# Altium project MB1246.PrjPCB
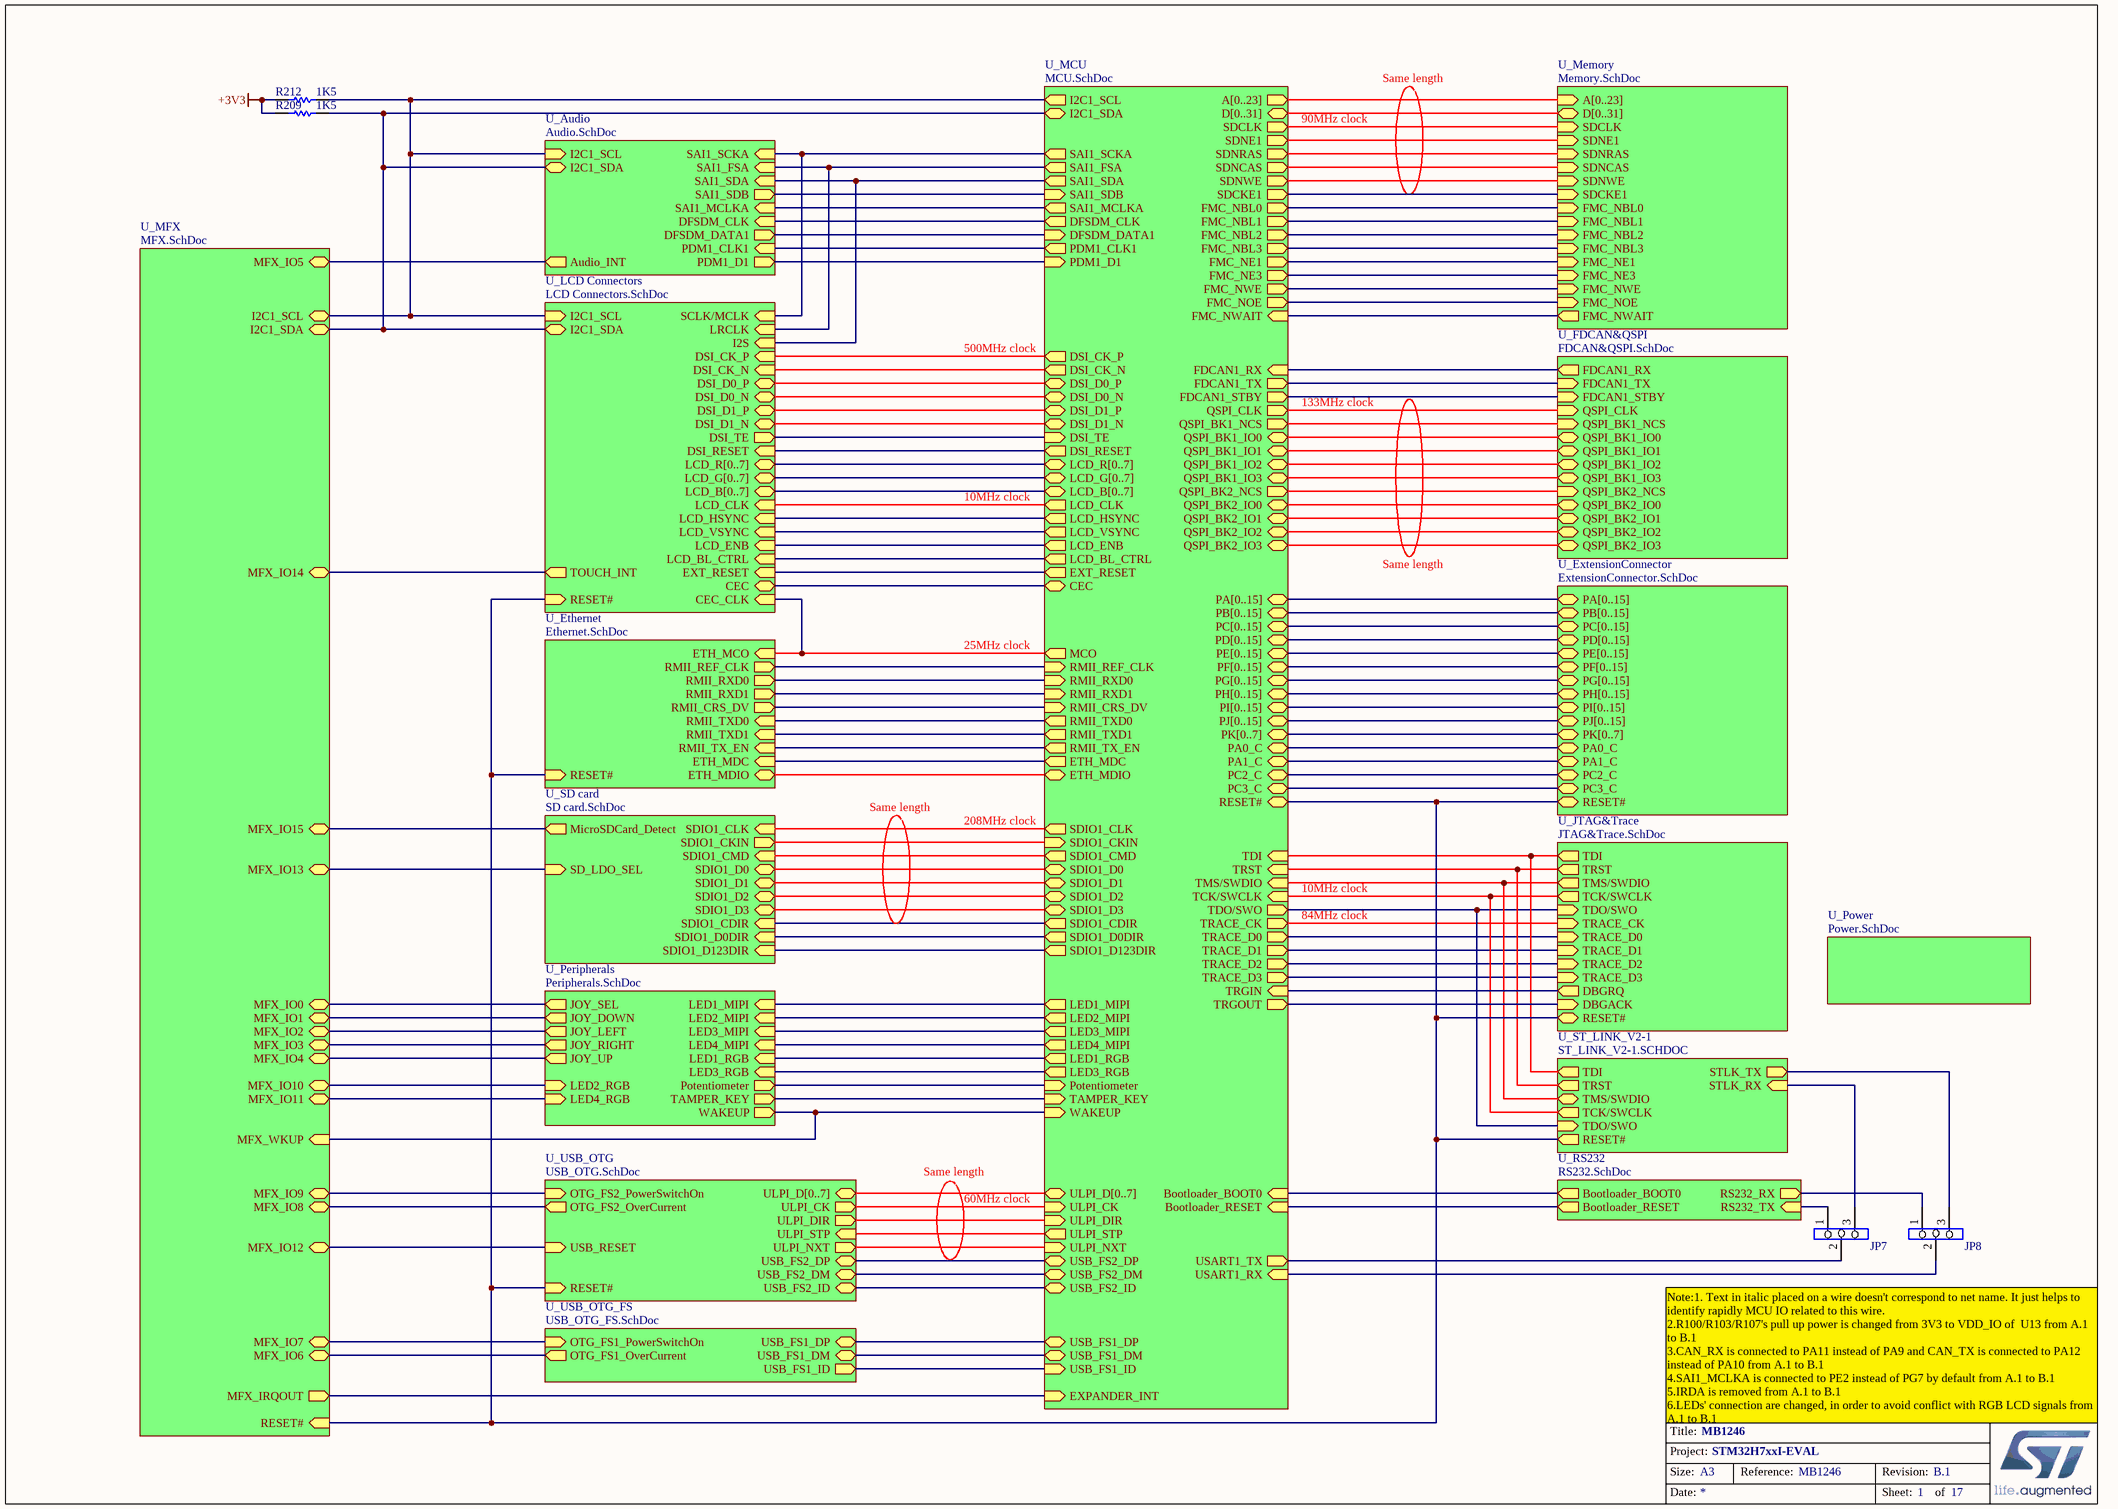
[diagram p0: MB1246.SchDoc]
4 sheets, 93 parts. Net scope: hierarchical (ports join the sheet entries above them; power ports are global).
Sheets:
  MB1246.SchDoc
    U_Audio = Audio.SchDoc
    U_MFX = MFX.SchDoc
    U_USB_OTG_FS = USB_OTG_FS.SchDoc

## Sheet MB1246.SchDoc: MB1246
size A3; DocumentNumber: MB1246; Revision: B.1; SheetNumber: 1; SheetTotal: 17; Project: STM32H7xxI-EVAL

### Parts
JP7  (no value)  [SIP3]
JP8  (no value)  [SIP3]
R209  1K5  [0603R]
R212  1K5  [0603R]

### Sub-sheets
U_Audio = Audio.SchDoc: SAI1_SCKA (in), SAI1_FSA (in), SAI1_SDA (in), SAI1_SDB (out), Audio_INT (out), I2C1_SDA (bidir), I2C1_SCL (in), SAI1_MCLKA (in), DFSDM_CLK (in), DFSDM_DATA1 (out), PDM1_CLK1 (in), PDM1_D1 (out)
U_Ethernet = Ethernet.SchDoc (file not in this document): ETH_MCO (in), RMII_TXD0 (in), RMII_TX_EN (in), RMII_RXD0 (out), RMII_REF_CLK (out), RMII_CRS_DV (out), ETH_MDC (in), ETH_MDIO (bidir), RMII_TXD1 (in), RMII_RXD1 (out), RESET# (in)
U_ExtensionConnector = ExtensionConnector.SchDoc (file not in this document): PA[0..15] (bidir), PB[0..15] (bidir), PC[0..15] (bidir), PD[0..15] (bidir), PE[0..15] (bidir), PF[0..15] (bidir), PG[0..15] (bidir), PH[0..15] (bidir), PI[0..15] (bidir), PJ[0..15] (bidir), PK[0..7] (bidir), RESET# (bidir), PA0_C (bidir), PA1_C (bidir), PC2_C (bidir), PC3_C (bidir)
U_FDCAN&QSPI = FDCAN&QSPI.SchDoc (file not in this document): FDCAN1_TX (in), FDCAN1_RX (out), FDCAN1_STBY (in), QSPI_BK1_IO3 (bidir), QSPI_BK1_IO1 (bidir), QSPI_BK1_NCS (in), QSPI_BK1_IO0 (bidir), QSPI_BK1_IO2 (bidir), QSPI_CLK (in), QSPI_BK2_NCS (in), QSPI_BK2_IO0 (bidir), QSPI_BK2_IO1 (bidir), QSPI_BK2_IO2 (bidir), QSPI_BK2_IO3 (bidir)
U_JTAG&Trace = JTAG&Trace.SchDoc (file not in this document): TDI (out), RESET# (bidir), TRACE_D3 (in), TRACE_D2 (in), TRACE_D1 (in), TRACE_D0 (in), TRACE_CK (in), TRST (out), TMS/SWDIO (out), TCK/SWCLK (out), TDO/SWO (in), DBGRQ (out), DBGACK (in)
U_LCD Connectors = LCD Connectors.SchDoc (file not in this document): LCD_R[0..7] (bidir), LCD_HSYNC (in), LCD_VSYNC (in), LCD_CLK (in), LCD_ENB (in), I2C1_SDA (bidir), I2C1_SCL (in), LCD_B[0..7] (bidir), LCD_G[0..7] (bidir), TOUCH_INT (out), EXT_RESET (in), DSI_CK_P (in), DSI_CK_N (in), DSI_D0_P (bidir), DSI_D0_N (bidir), DSI_D1_P (bidir), DSI_D1_N (bidir), LCD_BL_CTRL (in), DSI_TE (out), DSI_RESET (in), SCLK/MCLK (in), LRCLK (in), I2S (in), CEC (bidir), CEC_CLK (in), RESET# (in)
U_MCU = MCU.SchDoc (file not in this document): PA[0..15] (bidir), PB[0..15] (bidir), PC[0..15] (bidir), PD[0..15] (bidir), PE[0..15] (bidir), PF[0..15] (bidir), PG[0..15] (bidir), PH[0..15] (bidir), PI[0..15] (bidir), TMS/SWDIO (in), TCK/SWCLK (in), TDI (in), ULPI_STP (out), ETH_MDC (out), RMII_RXD0 (in), RMII_RXD1 (in), SDIO1_D0 (bidir), EXT_RESET (out), SDIO1_CLK (out), TAMPER_KEY (in), LCD_ENB (out), SDIO1_CMD (out), FMC_NOE (out), FMC_NWE (out), FMC_NWAIT (in), FMC_NE1 (out), FMC_NBL3 (out), FMC_NBL2 (out), EXPANDER_INT (in), ULPI_DIR (in), LCD_HSYNC (out), LCD_VSYNC (out), LCD_CLK (out), FMC_NBL0 (out), FMC_NBL1 (out), TRACE_CK (out), TRACE_D0 (out), TRACE_D2 (out), TRACE_D1 (out), SAI1_SDA (out), TRACE_D3 (out), SAI1_SDB (in), SAI1_SCKA (out), SAI1_FSA (out), SAI1_MCLKA (out), SDNRAS (out), SDCLK (out), FMC_NE3 (out), RMII_TX_EN (out), RMII_TXD1 (out), SDNCAS (out), SDCKE1 (out), SDNE1 (out), ULPI_NXT (in), SDNWE (out), LCD_G[0..7] (bidir), LCD_B[0..7] (bidir), D[0..31] (bidir), A[0..23] (out), ULPI_D[0..7] (bidir), PJ[0..15] (bidir), PK[0..7] (bidir), LCD_R[0..7] (bidir), QSPI_BK1_IO3 (bidir), QSPI_BK1_IO2 (bidir), QSPI_BK1_IO1 (bidir), QSPI_BK1_IO0 (bidir), DSI_TE (in), DSI_CK_P (out), DSI_CK_N (out), DSI_D0_P (bidir), DSI_D0_N (bidir), DSI_D1_P (bidir), DSI_D1_N (bidir), DSI_RESET (out), LED1_MIPI (out), LED2_MIPI (out), LED3_MIPI (out), LED4_MIPI (out), RMII_REF_CLK (in), ETH_MDIO (bidir), ULPI_CK (in), RMII_CRS_DV (in), LCD_BL_CTRL (out), USART1_TX (out), USART1_RX (in), USB_FS1_ID (in), FDCAN1_RX (in), USB_FS1_DM (bidir), FDCAN1_TX (out), USB_FS1_DP (bidir), MCO (out), WAKEUP (in), TDO/SWO (out), TRST (in), I2C1_SCL (out), I2C1_SDA (bidir), USB_FS2_ID (bidir), USB_FS2_DM (bidir), USB_FS2_DP (bidir), QSPI_BK1_NCS (out), RMII_TXD0 (out), QSPI_CLK (out), SDIO1_CKIN (in), SDIO1_CDIR (out), DFSDM_CLK (out), DFSDM_DATA1 (in), SDIO1_D0DIR (out), SDIO1_D123DIR (out), SDIO1_D1 (bidir), SDIO1_D2 (bidir), SDIO1_D3 (bidir), FDCAN1_STBY (out), PDM1_CLK1 (out), PDM1_D1 (in), QSPI_BK2_IO2 (bidir), QSPI_BK2_IO3 (bidir), QSPI_BK2_IO0 (bidir), QSPI_BK2_IO1 (bidir), RESET# (bidir), Bootloader_BOOT0 (in), Bootloader_RESET (in), PA0_C (bidir), PA1_C (bidir), PC2_C (bidir), PC3_C (bidir), QSPI_BK2_NCS (out), CEC (bidir), Potentiometer (in), TRGOUT (out), TRGIN (in), LED1_RGB (out), LED3_RGB (out)
U_Memory = Memory.SchDoc (file not in this document): FMC_NE1 (in), FMC_NWE (in), FMC_NOE (in), FMC_NWAIT (out), FMC_NBL0 (in), FMC_NBL1 (in), D[0..31] (bidir), A[0..23] (in), SDNCAS (in), SDNWE (in), SDNRAS (in), SDNE1 (in), SDCKE1 (in), SDCLK (in), FMC_NBL3 (in), FMC_NBL2 (in), FMC_NE3 (in)
U_MFX = MFX.SchDoc: MFX_IRQOUT (out), I2C1_SDA (bidir), I2C1_SCL (bidir), MFX_IO5 (bidir), MFX_IO6 (bidir), MFX_IO7 (bidir), MFX_IO8 (bidir), MFX_IO9 (bidir), MFX_IO10 (bidir), MFX_IO11 (bidir), MFX_IO12 (bidir), MFX_IO13 (bidir), MFX_IO14 (bidir), MFX_IO15 (bidir), MFX_WKUP (in), MFX_IO0 (bidir), MFX_IO1 (bidir), MFX_IO2 (bidir), MFX_IO3 (bidir), MFX_IO4 (bidir), RESET# (in)
U_Peripherals = Peripherals.SchDoc (file not in this document): JOY_SEL (out), JOY_DOWN (out), JOY_LEFT (out), JOY_RIGHT (out), JOY_UP (out), TAMPER_KEY (out), WAKEUP (out), Potentiometer (out), LED4_MIPI (in), LED3_MIPI (in), LED1_MIPI (in), LED2_MIPI (in), LED1_RGB (in), LED2_RGB (in), LED3_RGB (in), LED4_RGB (in)
U_Power = Power.SchDoc (file not in this document): no entries
U_RS232 = RS232.SchDoc (file not in this document): RS232_TX (in), RS232_RX (out), Bootloader_BOOT0 (out), Bootloader_RESET (out)
U_SD card = SD card.SchDoc (file not in this document): SDIO1_CKIN (out), SDIO1_CDIR (in), SDIO1_D0DIR (in), SDIO1_D123DIR (in), SDIO1_D0 (bidir), SDIO1_D1 (bidir), SDIO1_D2 (bidir), SDIO1_D3 (bidir), SDIO1_CMD (in), SDIO1_CLK (in), SD_LDO_SEL (in), MicroSDCard_Detect (out)
U_ST_LINK_V2-1 = ST_LINK_V2-1.SCHDOC (file not in this document): STLK_RX (in), STLK_TX (out), TDI (out), TRST (out), TMS/SWDIO (bidir), TCK/SWCLK (out), TDO/SWO (in), RESET# (out)
U_USB_OTG = USB_OTG.SchDoc (file not in this document): ULPI_D[0..7] (bidir), ULPI_CK (out), ULPI_DIR (out), ULPI_NXT (out), ULPI_STP (in), USB_RESET (in), USB_FS2_DM (bidir), USB_FS2_DP (bidir), OTG_FS2_PowerSwitchOn (in), OTG_FS2_OverCurrent (out), USB_FS2_ID (bidir), RESET# (in)
U_USB_OTG_FS = USB_OTG_FS.SchDoc: OTG_FS1_PowerSwitchOn (in), OTG_FS1_OverCurrent (out), USB_FS1_DM (bidir), USB_FS1_DP (bidir), USB_FS1_ID (out)

### Nets
+3V3: R209.1 R212.1
NetCN18_2: sheet U_USB_OTG_FS/USB_FS1_DM, sheet U_MCU/USB_FS1_DM
NetCN18_3: sheet U_USB_OTG_FS/USB_FS1_DP, sheet U_MCU/USB_FS1_DP
NetCN18_4: sheet U_USB_OTG_FS/USB_FS1_ID, sheet U_MCU/USB_FS1_ID
NetD15_2: sheet U_ExtensionConnector/RESET#, sheet U_MFX/RESET#, sheet U_ST_LINK_V2-1/RESET#, sheet U_JTAG&Trace/RESET#, sheet U_Ethernet/RESET#, sheet U_MCU/RESET#, sheet U_USB_OTG/RESET#, sheet U_LCD Connectors/RESET#
NetJP7_1: JP7.1 ; sheet U_RS232/RS232_TX
NetJP7_2: JP7.2 ; sheet U_MCU/USART1_TX
NetJP7_3: JP7.3 ; sheet U_ST_LINK_V2-1/STLK_RX
NetJP8_1: JP8.1 ; sheet U_RS232/RS232_RX
NetJP8_2: JP8.2 ; sheet U_MCU/USART1_RX
NetJP8_3: JP8.3 ; sheet U_ST_LINK_V2-1/STLK_TX
NetR141_2: sheet U_MFX/MFX_IO7, sheet U_USB_OTG_FS/OTG_FS1_PowerSwitchOn
NetR146_1: sheet U_MFX/MFX_IO6, sheet U_USB_OTG_FS/OTG_FS1_OverCurrent
NetR155_1: R212.2 ; sheet U_Audio/I2C1_SCL, sheet U_MFX/I2C1_SCL, sheet U_MCU/I2C1_SCL, sheet U_LCD Connectors/I2C1_SCL
NetR160_1: R209.2 ; sheet U_Audio/I2C1_SDA, sheet U_MFX/I2C1_SDA, sheet U_MCU/I2C1_SDA, sheet U_LCD Connectors/I2C1_SDA
NetR173_2: sheet U_MFX/MFX_WKUP, sheet U_Peripherals/WAKEUP, sheet U_MCU/WAKEUP
NetR185_1: sheet U_MFX/MFX_IRQOUT, sheet U_MCU/EXPANDER_INT
NetSW2_2: sheet U_Audio/DFSDM_CLK, sheet U_MCU/DFSDM_CLK
NetSW2_4: sheet U_Audio/PDM1_CLK1, sheet U_MCU/PDM1_CLK1
NetSW2_6: sheet U_Audio/DFSDM_DATA1, sheet U_MCU/DFSDM_DATA1
NetSW2_8: sheet U_Audio/PDM1_D1, sheet U_MCU/PDM1_D1
NetU22_D3: sheet U_Audio/SAI1_MCLKA, sheet U_MCU/SAI1_MCLKA
NetU22_E3: sheet U_Audio/SAI1_FSA, sheet U_MCU/SAI1_FSA, sheet U_LCD Connectors/LRCLK
NetU22_E4: sheet U_Audio/SAI1_SDA, sheet U_MCU/SAI1_SDA, sheet U_LCD Connectors/I2S
NetU22_F2: sheet U_Audio/SAI1_SDB, sheet U_MCU/SAI1_SDB
NetU22_G1: sheet U_Audio/SAI1_SCKA, sheet U_MCU/SAI1_SCKA, sheet U_LCD Connectors/SCLK/MCLK
NetU22_G3: sheet U_Audio/Audio_INT, sheet U_MFX/MFX_IO5
NetU24_18: sheet U_MFX/MFX_IO0, sheet U_Peripherals/JOY_SEL
NetU24_19: sheet U_MFX/MFX_IO1, sheet U_Peripherals/JOY_DOWN
NetU24_20: sheet U_MFX/MFX_IO2, sheet U_Peripherals/JOY_LEFT
NetU24_26: sheet U_MFX/MFX_IO13, sheet U_SD card/SD_LDO_SEL
NetU24_27: sheet U_MFX/MFX_IO14, sheet U_LCD Connectors/TOUCH_INT
NetU24_28: sheet U_MFX/MFX_IO15, sheet U_SD card/MicroSDCard_Detect
NetU24_29: sheet U_MFX/MFX_IO8, sheet U_USB_OTG/OTG_FS2_OverCurrent
NetU24_30: sheet U_MFX/MFX_IO9, sheet U_USB_OTG/OTG_FS2_PowerSwitchOn
NetU24_31: sheet U_MFX/MFX_IO10, sheet U_Peripherals/LED2_RGB
NetU24_32: sheet U_MFX/MFX_IO11, sheet U_Peripherals/LED4_RGB
NetU24_33: sheet U_MFX/MFX_IO12, sheet U_USB_OTG/USB_RESET
NetU24_39: sheet U_MFX/MFX_IO3, sheet U_Peripherals/JOY_RIGHT
NetU24_40: sheet U_MFX/MFX_IO4, sheet U_Peripherals/JOY_UP
(unnamed): sheet U_ExtensionConnector/PA0_C, sheet U_MCU/PA0_C
(unnamed): sheet U_ExtensionConnector/PA1_C, sheet U_MCU/PA1_C
(unnamed): sheet U_ExtensionConnector/PC2_C, sheet U_MCU/PC2_C
(unnamed): sheet U_ExtensionConnector/PC3_C, sheet U_MCU/PC3_C
(unnamed): sheet U_FDCAN&QSPI/FDCAN1_TX, sheet U_MCU/FDCAN1_TX
(unnamed): sheet U_FDCAN&QSPI/FDCAN1_RX, sheet U_MCU/FDCAN1_RX
(unnamed): sheet U_FDCAN&QSPI/FDCAN1_STBY, sheet U_MCU/FDCAN1_STBY
(unnamed): sheet U_FDCAN&QSPI/QSPI_BK1_IO3, sheet U_MCU/QSPI_BK1_IO3
(unnamed): sheet U_FDCAN&QSPI/QSPI_BK1_IO1, sheet U_MCU/QSPI_BK1_IO1
(unnamed): sheet U_FDCAN&QSPI/QSPI_BK1_NCS, sheet U_MCU/QSPI_BK1_NCS
(unnamed): sheet U_FDCAN&QSPI/QSPI_BK1_IO0, sheet U_MCU/QSPI_BK1_IO0
(unnamed): sheet U_FDCAN&QSPI/QSPI_BK1_IO2, sheet U_MCU/QSPI_BK1_IO2
(unnamed): sheet U_FDCAN&QSPI/QSPI_CLK, sheet U_MCU/QSPI_CLK
(unnamed): sheet U_FDCAN&QSPI/QSPI_BK2_NCS, sheet U_MCU/QSPI_BK2_NCS
(unnamed): sheet U_FDCAN&QSPI/QSPI_BK2_IO0, sheet U_MCU/QSPI_BK2_IO0
(unnamed): sheet U_FDCAN&QSPI/QSPI_BK2_IO1, sheet U_MCU/QSPI_BK2_IO1
(unnamed): sheet U_FDCAN&QSPI/QSPI_BK2_IO2, sheet U_MCU/QSPI_BK2_IO2
(unnamed): sheet U_FDCAN&QSPI/QSPI_BK2_IO3, sheet U_MCU/QSPI_BK2_IO3
(unnamed): sheet U_Memory/FMC_NE1, sheet U_MCU/FMC_NE1
(unnamed): sheet U_Memory/FMC_NWE, sheet U_MCU/FMC_NWE
(unnamed): sheet U_Memory/FMC_NOE, sheet U_MCU/FMC_NOE
(unnamed): sheet U_Memory/FMC_NWAIT, sheet U_MCU/FMC_NWAIT
(unnamed): sheet U_Memory/FMC_NBL0, sheet U_MCU/FMC_NBL0
(unnamed): sheet U_Memory/FMC_NBL1, sheet U_MCU/FMC_NBL1
(unnamed): sheet U_Memory/SDNCAS, sheet U_MCU/SDNCAS
(unnamed): sheet U_Memory/SDNWE, sheet U_MCU/SDNWE
(unnamed): sheet U_Memory/SDNRAS, sheet U_MCU/SDNRAS
(unnamed): sheet U_Memory/SDNE1, sheet U_MCU/SDNE1
(unnamed): sheet U_Memory/SDCKE1, sheet U_MCU/SDCKE1
(unnamed): sheet U_Memory/SDCLK, sheet U_MCU/SDCLK
(unnamed): sheet U_Memory/FMC_NBL3, sheet U_MCU/FMC_NBL3
(unnamed): sheet U_Memory/FMC_NBL2, sheet U_MCU/FMC_NBL2
(unnamed): sheet U_Memory/FMC_NE3, sheet U_MCU/FMC_NE3
(unnamed): sheet U_ST_LINK_V2-1/TDI, sheet U_JTAG&Trace/TDI, sheet U_MCU/TDI
(unnamed): sheet U_ST_LINK_V2-1/TRST, sheet U_JTAG&Trace/TRST, sheet U_MCU/TRST
(unnamed): sheet U_ST_LINK_V2-1/TMS/SWDIO, sheet U_JTAG&Trace/TMS/SWDIO, sheet U_MCU/TMS/SWDIO
(unnamed): sheet U_ST_LINK_V2-1/TCK/SWCLK, sheet U_JTAG&Trace/TCK/SWCLK, sheet U_MCU/TCK/SWCLK
(unnamed): sheet U_ST_LINK_V2-1/TDO/SWO, sheet U_JTAG&Trace/TDO/SWO, sheet U_MCU/TDO/SWO
(unnamed): sheet U_SD card/SDIO1_CKIN, sheet U_MCU/SDIO1_CKIN
(unnamed): sheet U_SD card/SDIO1_CDIR, sheet U_MCU/SDIO1_CDIR
(unnamed): sheet U_SD card/SDIO1_D0DIR, sheet U_MCU/SDIO1_D0DIR
(unnamed): sheet U_SD card/SDIO1_D123DIR, sheet U_MCU/SDIO1_D123DIR
(unnamed): sheet U_SD card/SDIO1_D0, sheet U_MCU/SDIO1_D0
(unnamed): sheet U_SD card/SDIO1_D1, sheet U_MCU/SDIO1_D1
(unnamed): sheet U_SD card/SDIO1_D2, sheet U_MCU/SDIO1_D2
(unnamed): sheet U_SD card/SDIO1_D3, sheet U_MCU/SDIO1_D3
(unnamed): sheet U_SD card/SDIO1_CMD, sheet U_MCU/SDIO1_CMD
(unnamed): sheet U_SD card/SDIO1_CLK, sheet U_MCU/SDIO1_CLK
(unnamed): sheet U_JTAG&Trace/TRACE_D3, sheet U_MCU/TRACE_D3
(unnamed): sheet U_JTAG&Trace/TRACE_D2, sheet U_MCU/TRACE_D2
(unnamed): sheet U_JTAG&Trace/TRACE_D1, sheet U_MCU/TRACE_D1
(unnamed): sheet U_JTAG&Trace/TRACE_D0, sheet U_MCU/TRACE_D0
(unnamed): sheet U_JTAG&Trace/TRACE_CK, sheet U_MCU/TRACE_CK
(unnamed): sheet U_JTAG&Trace/DBGRQ, sheet U_MCU/TRGIN
(unnamed): sheet U_JTAG&Trace/DBGACK, sheet U_MCU/TRGOUT
(unnamed): sheet U_Ethernet/ETH_MCO, sheet U_MCU/MCO, sheet U_LCD Connectors/CEC_CLK
(unnamed): sheet U_Ethernet/RMII_TXD0, sheet U_MCU/RMII_TXD0
(unnamed): sheet U_Ethernet/RMII_TX_EN, sheet U_MCU/RMII_TX_EN
(unnamed): sheet U_Ethernet/RMII_RXD0, sheet U_MCU/RMII_RXD0
(unnamed): sheet U_Ethernet/RMII_REF_CLK, sheet U_MCU/RMII_REF_CLK
(unnamed): sheet U_Ethernet/RMII_CRS_DV, sheet U_MCU/RMII_CRS_DV
(unnamed): sheet U_Ethernet/ETH_MDC, sheet U_MCU/ETH_MDC
(unnamed): sheet U_Ethernet/ETH_MDIO, sheet U_MCU/ETH_MDIO
(unnamed): sheet U_Ethernet/RMII_TXD1, sheet U_MCU/RMII_TXD1
(unnamed): sheet U_Ethernet/RMII_RXD1, sheet U_MCU/RMII_RXD1
(unnamed): sheet U_RS232/Bootloader_BOOT0, sheet U_MCU/Bootloader_BOOT0
(unnamed): sheet U_RS232/Bootloader_RESET, sheet U_MCU/Bootloader_RESET
(unnamed): sheet U_Peripherals/TAMPER_KEY, sheet U_MCU/TAMPER_KEY
(unnamed): sheet U_Peripherals/Potentiometer, sheet U_MCU/Potentiometer
(unnamed): sheet U_Peripherals/LED4_MIPI, sheet U_MCU/LED4_MIPI
(unnamed): sheet U_Peripherals/LED3_MIPI, sheet U_MCU/LED3_MIPI
(unnamed): sheet U_Peripherals/LED1_MIPI, sheet U_MCU/LED1_MIPI
(unnamed): sheet U_Peripherals/LED2_MIPI, sheet U_MCU/LED2_MIPI
(unnamed): sheet U_Peripherals/LED1_RGB, sheet U_MCU/LED1_RGB
(unnamed): sheet U_Peripherals/LED3_RGB, sheet U_MCU/LED3_RGB
(unnamed): sheet U_MCU/ULPI_STP, sheet U_USB_OTG/ULPI_STP
(unnamed): sheet U_MCU/EXT_RESET, sheet U_LCD Connectors/EXT_RESET
(unnamed): sheet U_MCU/LCD_ENB, sheet U_LCD Connectors/LCD_ENB
(unnamed): sheet U_MCU/ULPI_DIR, sheet U_USB_OTG/ULPI_DIR
(unnamed): sheet U_MCU/LCD_HSYNC, sheet U_LCD Connectors/LCD_HSYNC
(unnamed): sheet U_MCU/LCD_VSYNC, sheet U_LCD Connectors/LCD_VSYNC
(unnamed): sheet U_MCU/LCD_CLK, sheet U_LCD Connectors/LCD_CLK
(unnamed): sheet U_MCU/ULPI_NXT, sheet U_USB_OTG/ULPI_NXT
(unnamed): sheet U_MCU/DSI_TE, sheet U_LCD Connectors/DSI_TE
(unnamed): sheet U_MCU/DSI_CK_P, sheet U_LCD Connectors/DSI_CK_P
(unnamed): sheet U_MCU/DSI_CK_N, sheet U_LCD Connectors/DSI_CK_N
(unnamed): sheet U_MCU/DSI_D0_P, sheet U_LCD Connectors/DSI_D0_P
(unnamed): sheet U_MCU/DSI_D0_N, sheet U_LCD Connectors/DSI_D0_N
(unnamed): sheet U_MCU/DSI_D1_P, sheet U_LCD Connectors/DSI_D1_P
(unnamed): sheet U_MCU/DSI_D1_N, sheet U_LCD Connectors/DSI_D1_N
(unnamed): sheet U_MCU/DSI_RESET, sheet U_LCD Connectors/DSI_RESET
(unnamed): sheet U_MCU/ULPI_CK, sheet U_USB_OTG/ULPI_CK
(unnamed): sheet U_MCU/LCD_BL_CTRL, sheet U_LCD Connectors/LCD_BL_CTRL
(unnamed): sheet U_MCU/USB_FS2_ID, sheet U_USB_OTG/USB_FS2_ID
(unnamed): sheet U_MCU/USB_FS2_DM, sheet U_USB_OTG/USB_FS2_DM
(unnamed): sheet U_MCU/USB_FS2_DP, sheet U_USB_OTG/USB_FS2_DP
(unnamed): sheet U_MCU/CEC, sheet U_LCD Connectors/CEC

### Buses and harness runs
bus sheet U_ExtensionConnector/PA[0..15] = sheet U_MCU/PA[0..15]
bus sheet U_ExtensionConnector/PB[0..15] = sheet U_MCU/PB[0..15]
bus sheet U_ExtensionConnector/PC[0..15] = sheet U_MCU/PC[0..15]
bus sheet U_ExtensionConnector/PD[0..15] = sheet U_MCU/PD[0..15]
bus sheet U_ExtensionConnector/PE[0..15] = sheet U_MCU/PE[0..15]
bus sheet U_ExtensionConnector/PF[0..15] = sheet U_MCU/PF[0..15]
bus sheet U_ExtensionConnector/PG[0..15] = sheet U_MCU/PG[0..15]
bus sheet U_ExtensionConnector/PH[0..15] = sheet U_MCU/PH[0..15]
bus sheet U_ExtensionConnector/PI[0..15] = sheet U_MCU/PI[0..15]
bus sheet U_ExtensionConnector/PJ[0..15] = sheet U_MCU/PJ[0..15]
bus sheet U_ExtensionConnector/PK[0..7] = sheet U_MCU/PK[0..7]
bus sheet U_LCD Connectors/LCD_B[0..7] = sheet U_MCU/LCD_B[0..7]
bus sheet U_LCD Connectors/LCD_G[0..7] = sheet U_MCU/LCD_G[0..7]
bus sheet U_LCD Connectors/LCD_R[0..7] = sheet U_MCU/LCD_R[0..7]
bus sheet U_MCU/A[0..23] = sheet U_Memory/A[0..23]
bus sheet U_MCU/D[0..31] = sheet U_Memory/D[0..31]
bus sheet U_MCU/ULPI_D[0..7] = sheet U_USB_OTG/ULPI_D[0..7]

### Notes on the sheet
- Same length
- 90MHz clock
- 500MHz clock
- 133MHz clock
- 10MHz clock
- 25MHz clock
- 208MHz clock
- 84MHz clock
- 60MHz clock
- Note:1. Text in italic placed on a wire doesn't correspond to net name. It just helps to identify rapidly MCU IO related to this wire.
  2.R100/R103/R107's pull up power is changed from 3V3 to VDD_IO of  U13 from A.1 to B.1
  3.CAN_RX is connected to PA11 instead of PA9 and CAN_TX is connected to PA12 instead of PA10 from A.1 to B.1
  4.SAI1_MCLKA is connected to PE2 instead of PG7 by default from A.1 to B.1
  5.IRDA is removed from A.1 to B.1
  6.LEDs' connection are changed, in order to avoid conflict with RGB LCD signals from A.1 to B.1
- Title:
- Project:
- Size:
- Date:
- A3
- Reference:
- Sheet:
- Revision:
- of

### Library data of the parts
JP7 JP8 = Jumper3
R209 R212 = Res1: Resistor; Value: 1K; Published: 8-Jun-2000; Revision: July-2002: Re-released for DXP Platform.; Publisher: Altium Limited

## Sheet Audio.SchDoc: Audio
size A4; DocumentNumber: MB1246; Revision: B.1; SheetNumber: 5; SheetTotal: 17; Project: STM32H7xxI-EVAL
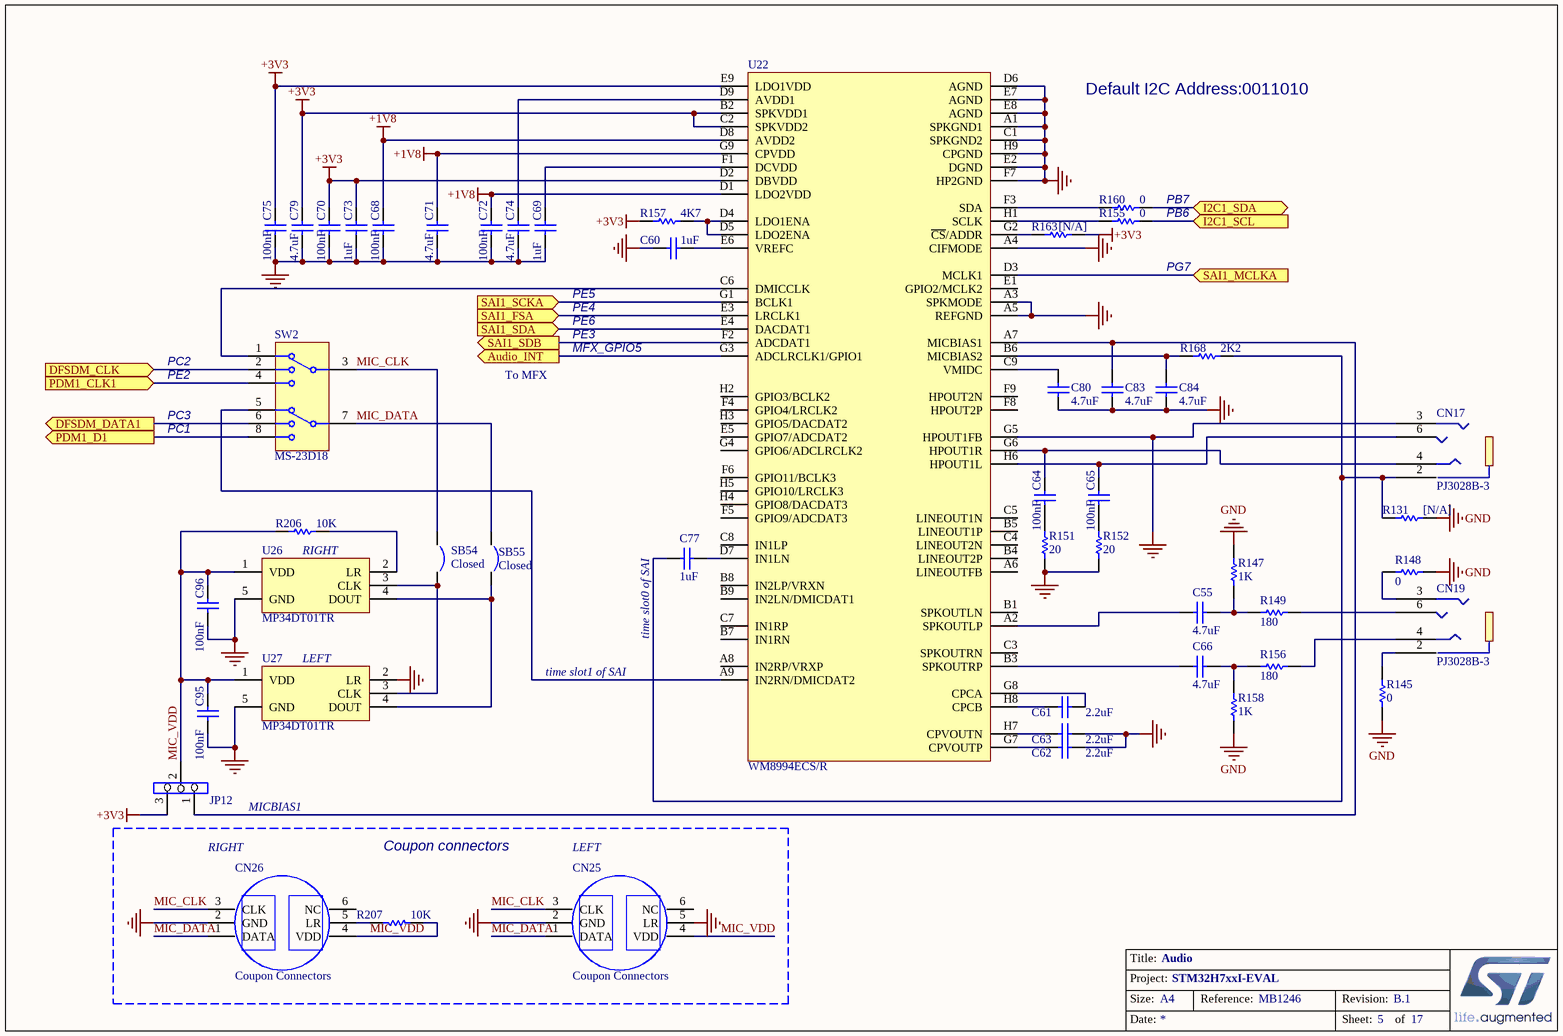
[diagram p1: Audio.SchDoc]

### Parts
C55  4.7uF  [0603C]
C60  1uF  [0603C]
C61  2.2uF  [0603C]
C62  2.2uF  [0603C]
C63  2.2uF  [0603C]
C64  100nF  [0603C]
C65  100nF  [0603C]
C66  4.7uF  [0603C]
C68  100nF  [0603C]
C69  1uF  [0603C]
C70  100nF  [0603C]
C71  4.7uF  [0603C]
C72  100nF  [0603C]
C73  1uF  [0603C]
C74  4.7uF  [0603C]
C75  100nF  [0603C]
C77  1uF  [0603C]
C79  4.7uF  [0603C]
C80  4.7uF  [0603C]
C83  4.7uF  [0603C]
C84  4.7uF  [0603C]
C95  100nF  [0603C]
C96  100nF  [0603C]
CN17  PJ3028B-3  [PJ3028B]
CN19  PJ3028B-3  [PJ3028B]
CN25  Coupon Connectors  [Coupon]
CN26  Coupon Connectors  [Coupon]
JP12  (no value)  [SIP3]
R131  [N/A]  [0603R]
R145  0  [0603R]
R147  1K  [0402R]
R148  0  [0603R]
R149  180  [0402R]
R151  20  [0603R]
R152  20  [0603R]
R155  0  [0603R]
R156  180  [0402R]
R157  4K7  [0603R]
R158  1K  [0402R]
R160  0  [0603R]
R163  [N/A]  [0603R]
R168  2K2  [0603R]
R206  10K  [0603R]
R207  10K  [0603R]
SB54  Closed  [SB_0603]
SB55  Closed  [SB_0603]
SW2  MS-23D18  [SW1_8TH_13X3R5]
U22  WM8994ECS/R  [BGA72_0R5_4R5X4]
U26  MP34DT01TR  [MP34DT01TR]
U27  MP34DT01TR  [MP34DT01TR]

### Blocks framed on the sheet
Coupon connectors: CN25 CN26 R207

### Ports
Audio_INT (out), DFSDM_CLK (in), DFSDM_DATA1 (out), I2C1_SCL (in), I2C1_SDA (bidir), PDM1_CLK1 (in), PDM1_D1 (out), SAI1_FSA (in), SAI1_MCLKA (in), SAI1_SCKA (in), SAI1_SDA (in), SAI1_SDB (out)

### Nets
+1V8: C68.1 C71.1 C72.1 U22.D1(LDO2VDD) U22.D8(AVDD2) U22.G9(CPVDD)
+3V3: C70.1 C73.1 C75.1 C79.1 JP12.3 R157.2 R163.1 U22.B2(SPKVDD1) U22.C2(SPKVDD2) U22.D2(DBVDD) U22.E9(LDO1VDD)
GND: C60.2 C62.2 C63.2 C68.2 C69.2 C70.2 C71.2 C72.2 C73.2 C74.2 C75.2 C79.2 C80.1 C83.1 C84.1 C95.2 C96.2 CN17.3 CN25.2(GND) CN25.5(LR) CN26.2(GND) R131.1 R145.2 R147.2 R148.2 R151.2 R152.2 R158.1 U22.A1(SPKGND1) U22.A3(SPKMODE) U22.A4(CIFMODE) U22.A5(REFGND) U22.C1(SPKGND2) U22.D6(AGND) U22.E2(DGND) U22.E7(AGND) U22.E8(AGND) U22.F7(HP2GND) U22.G5(HPOUT1FB) U22.H9(CPGND) U26.5(GND) U27.2(LR) U27.5(GND)
MIC_CLK: CN25.3(CLK) CN26.3(CLK) SB54.1 SW2.3
MIC_DATA: CN25.1(DATA) CN26.1(DATA) SB55.1 SW2.7
MIC_VDD: C95.1 C96.1 CN25.4(VDD) CN26.4(VDD) JP12.2 R206.2 R207.2 U26.1(VDD) U27.1(VDD)
NetC55_1: C55.1 R147.1 R149.1
NetC55_2: C55.2 U22.A2(SPKOUTLP)
NetC60_1: C60.1 U22.E6(VREFC)
NetC61_1: C61.1 U22.H8(CPCB)
NetC61_2: C61.2 U22.G8(CPCA)
NetC62_1: C62.1 U22.G7(CPVOUTP)
NetC63_1: C63.1 U22.H7(CPVOUTN)
NetC64_1: C64.1 CN17.4 U22.G6(HPOUT1R)
NetC64_2: C64.2 R151.1
NetC65_1: C65.1 CN17.6 U22.H6(HPOUT1L)
NetC65_2: C65.2 R152.1
NetC66_1: C66.1 R156.2 R158.2
NetC66_2: C66.2 U22.B3(SPKOUTRP)
NetC69_1: C69.1 U22.F1(DCVDD)
NetC74_1: C74.1 U22.D9(AVDD1)
NetC77_1: C77.1 U22.D7(IN1LN)
NetC77_2: C77.2 CN17.2 R131.2 R168.1
NetC80_2: C80.2 U22.C9(VMIDC)
NetC83_2: C83.2 JP12.1 U22.A7(MICBIAS1)
NetC84_2: C84.2 R168.2 U22.B6(MICBIAS2)
NetCN19_2: CN19.2 R145.1
NetCN19_3: CN19.3 R148.1
NetCN19_4: CN19.4 R156.1
NetCN19_6: CN19.6 R149.2
NetCN26_5: CN26.5(LR) R207.1
NetR155_1: R155.1 ; port I2C1_SCL
NetR155_2: R155.2 U22.H1(SCLK)
NetR157_1: R157.1 U22.D4(LDO1ENA) U22.D5(LDO2ENA)
NetR160_1: R160.1 ; port I2C1_SDA
NetR160_2: R160.2 U22.F3(SDA)
NetR163_2: R163.2 U22.G2(~{CS}/ADDR)
NetR206_1: R206.1 U26.2(LR)
NetSB54_2: SB54.2 U26.3(CLK) U27.3(CLK)
NetSB55_2: SB55.2 U26.4(DOUT) U27.4(DOUT)
NetSW2_1: SW2.1 U22.C6(DMICCLK)
NetSW2_2: SW2.2 ; port DFSDM_CLK
NetSW2_4: SW2.4 ; port PDM1_CLK1
NetSW2_5: SW2.5 U22.A9(IN2RN/DMICDAT2)
NetSW2_6: SW2.6 ; port DFSDM_DATA1
NetSW2_8: SW2.8 ; port PDM1_D1
NetU22_D3: U22.D3(MCLK1) ; port SAI1_MCLKA
NetU22_E3: U22.E3(LRCLK1) ; port SAI1_FSA
NetU22_E4: U22.E4(DACDAT1) ; port SAI1_SDA
NetU22_F2: U22.F2(ADCDAT1) ; port SAI1_SDB
NetU22_G1: U22.G1(BCLK1) ; port SAI1_SCKA
NetU22_G3: U22.G3(ADCLRCLK1/GPIO1) ; port Audio_INT

Not connected (* = marked no-connect by the designer): CN25 6(NC); CN26 6(NC); U22 A6(LINEOUTFB) A8(IN2RP/VRXP) B1(SPKOUTLN) B4(LINEOUT2P) B5(LINEOUT1P) B7(IN1RN) B8(IN2LP/VRXN) B9(IN2LN/DMICDAT1) C3(SPKOUTRN) C4(LINEOUT2N) C5(LINEOUT1N) C7(IN1RP) C8(IN1LP) E1(GPIO2/MCLK2) E5(GPIO7/ADCDAT2) F4(GPIO4/LRCLK2) F5(GPIO9/ADCDAT3) F6(GPIO11/BCLK3) F8(HPOUT2P) F9(HPOUT2N) G4(GPIO6/ADCLRCLK2) H2(GPIO3/BCLK2) H3(GPIO5/DACDAT2) H4(GPIO8/DACDAT3) H5(GPIO10/LRCLK3)

### Notes on the sheet
- Default I2C Address:0011010
- PB7
- PB6
- PE5
- PE4
- PG7
- PC2
- PE2
- To MFX
- PE6
- PE3
- MFX_GPIO5
- PC3
- PC1
- RIGHT
- (near C77) time slot0 of SAI
- (near U27) LEFT
- time slot1 of SAI
- MICBIAS1
- LEFT
- Title:
- Project:
- Size:
- Date:
- A4
- Reference:
- Sheet:
- Revision:
- of

### Library data of the parts
C55 C66 = Cap: Capacitor; Value: 10nF; Ordered by: Subcon; Published: 8-Jun-2000; Revision: July-2002: Re-released for DXP Platform.; Publisher: Altium Limited
C60-C63 C69 C73 C77 = CAP: Capacitor; Value: 100nF; Published: 8-Jun-2000; Revision: July-2002: Re-released for DXP Platform.; Publisher: Altium Limited
C64 C65 C68 C70-C72 C74 C75 C79 C80 C83 C84 C95 C96 = Cap: Capacitor; Value: 10nF; Published: 8-Jun-2000; Revision: July-2002: Re-released for DXP Platform.; Publisher: Altium Limited
CN25 CN26 = Coupon Connectors: Header, 3-Pin, Single row; Revision: 17-Jul-2002: Re-released for DXP Platform.; Publisher: Altium Limited
JP12 = Jumper3
R131 R151 R152 R155 R157 R160 R163 R168 R206 R207 = Res1: Resistor; Value: 1K; Published: 8-Jun-2000; Revision: July-2002: Re-released for DXP Platform.; Publisher: Altium Limited
R145 R148 R149 R156 = Res1: Resistor; Value: 1K; Ordered by: Subcon; Published: 8-Jun-2000; Revision: July-2002: Re-released for DXP Platform.; Publisher: Altium Limited
R147 R158 = Res1: Resistor; Ordered by: Subcon; Published: 8-Jun-2000; Revision: July-2002: Re-released for DXP Platform.; Publisher: Altium Limited; Value: 1K
SB54 SB55 = Circuit Breaker_close: Circuit Breaker; Published: 24-Mar-1999; Revision: July-2002: Re-released for DXP Platform.; Publisher: Altium Limited
SW2 = MS-23D18: DPDT; Revision 1: Jul-2002: Re-released for DXP Platform.; Revision 2: 17-Dec-2003: Schematic revised, PCB Footprint replaced.; Published: 24-Mar-1999; Datasheet: Latest Revision: 05-Dec-2000; Publisher: Altium Limited
U26 U27 = MP34DT01TR: MEMS audio sensor; Revision: 17-Jul-2002: Re-released for DXP Platform.; Publisher: Altium Limited

## Sheet MFX.SchDoc: MFX
size A4; DocumentNumber: MB1246; Revision: B.1; SheetNumber: 16; SheetTotal: 17; Project: STM32H7xxI-EVAL
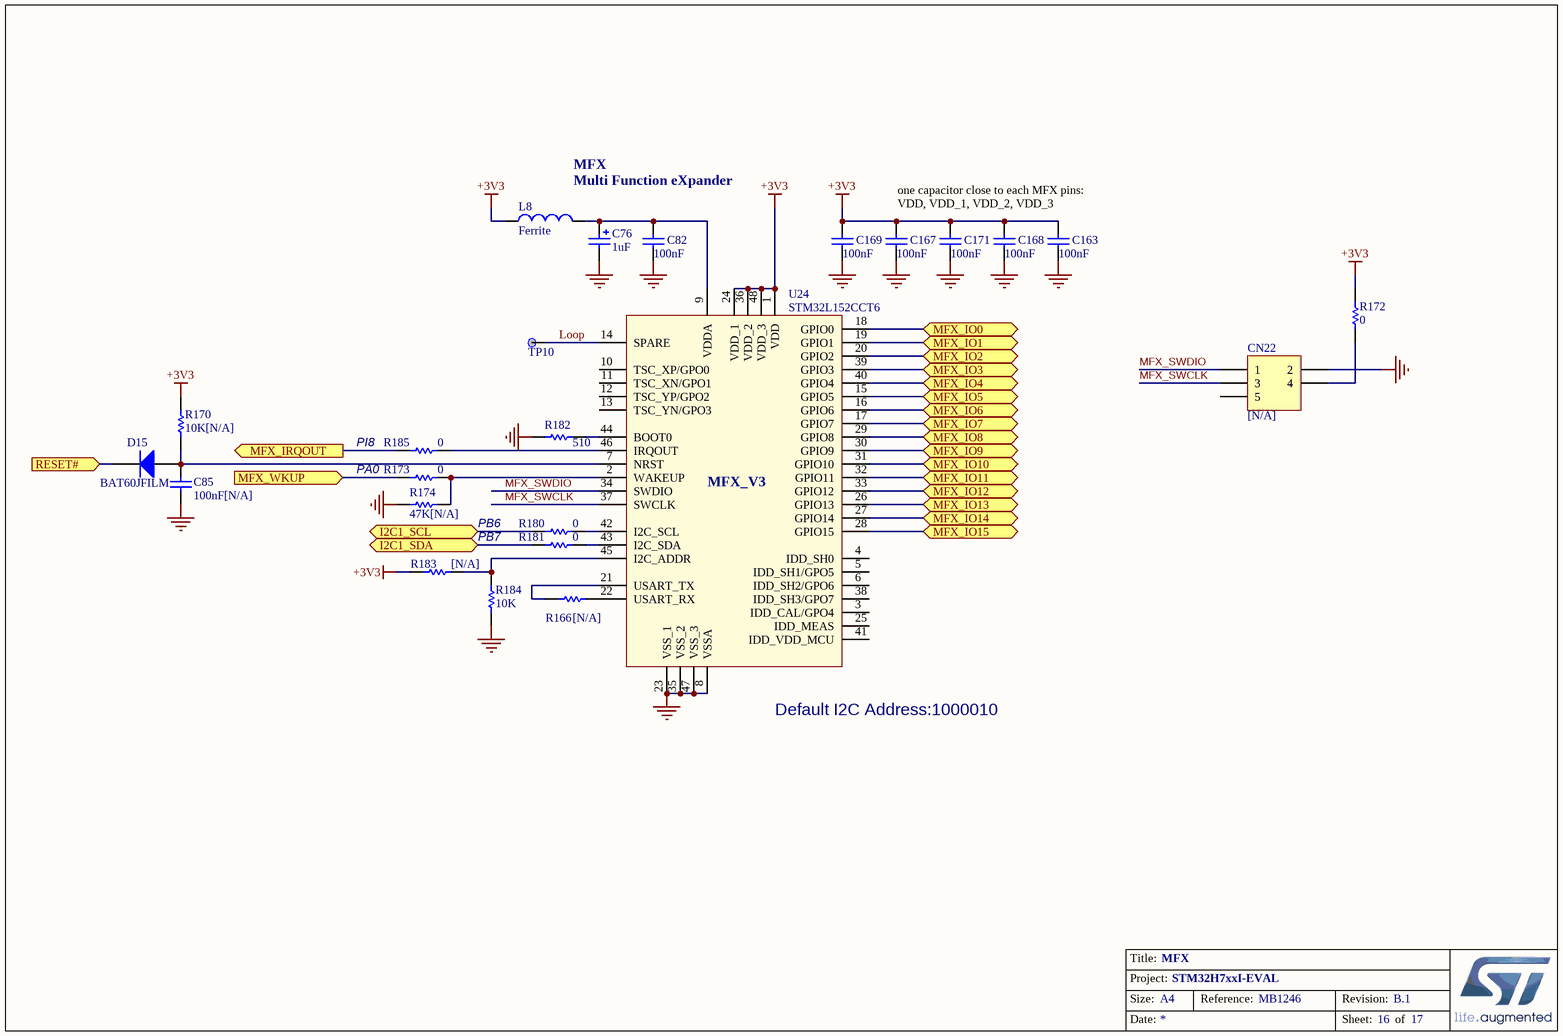
[diagram p2: MFX.SchDoc]

### Parts
C76  1uF  [TAN-A]
C82  100nF  [0402C]
C85  100nF[N/A]  [0402C]
C163  100nF  [0402C]
C167  100nF  [0402C]
C168  100nF  [0402C]
C169  100nF  [0402C]
C171  100nF  [0402C]
CN22  [N/A]  [HDR_2X3-1_2R54-6]
D15  BAT60JFILM  [SOD-323]
L8  Ferrite  [0603L]
R166  [N/A]  [0603R]
R170  10K[N/A]  [0402R]
R172  0  [0603R]
R173  0  [0603R]
R174  47K[N/A]  [0402R]
R180  0  [0603R]
R181  0  [0603R]
R182  510  [0402R]
R183  [N/A]  [0603R]
R184  10K  [0402R]
R185  0  [0603R]
TP10  (no value)  [TP]
U24  STM32L152CCT6  [LQFP48_0R5_9X9]

### Ports
I2C1_SCL (bidir), I2C1_SDA (bidir), MFX_IO0 (bidir), MFX_IO1 (bidir), MFX_IO2 (bidir), MFX_IO3 (bidir), MFX_IO4 (bidir), MFX_IO5 (bidir), MFX_IO6 (bidir), MFX_IO7 (bidir), MFX_IO8 (bidir), MFX_IO9 (bidir), MFX_IO10 (bidir), MFX_IO11 (bidir), MFX_IO12 (bidir), MFX_IO13 (bidir), MFX_IO14 (bidir), MFX_IO15 (bidir), MFX_IRQOUT (out), MFX_WKUP (in), RESET# (in)

### Nets
+3V3: C163.2 C167.2 C168.2 C169.2 C171.1 L8.1 R170.2 R172.1 R183.2 U24.1(VDD) U24.24(VDD_1) U24.36(VDD_2) U24.48(VDD_3)
GND: C76.2 C82.1 C85.1 C163.1 C167.1 C168.1 C169.1 C171.2 CN22.2 R174.1 R182.2 R184.2 U24.8(VSSA) U24.23(VSS_1) U24.35(VSS_2) U24.47(VSS_3)
Loop: TP10.1 U24.14(SPARE)
MFX_SWCLK: CN22.3 U24.37(SWCLK)
MFX_SWDIO: CN22.1 U24.34(SWDIO)
NetC76_1: C76.1 C82.2 L8.2 U24.9(VDDA)
NetC85_2: C85.2 D15.1(A) R170.1 U24.7(NRST)
NetCN22_4: CN22.4 R172.2
NetD15_2: D15.2(K) ; port RESET#
NetR141_2: U24.17(GPIO7) ; port MFX_IO7
NetR146_1: U24.16(GPIO6) ; port MFX_IO6
NetR155_1: R180.1 ; port I2C1_SCL
NetR160_1: R181.1 ; port I2C1_SDA
NetR166_1: R166.1 U24.21(USART_TX)
NetR166_2: R166.2 U24.22(USART_RX)
NetR173_1: R173.1 R174.2 U24.2(WAKEUP)
NetR173_2: R173.2 ; port MFX_WKUP
NetR180_2: R180.2 U24.42(I2C_SCL)
NetR181_2: R181.2 U24.43(I2C_SDA)
NetR182_1: R182.1 U24.44(BOOT0)
NetR183_1: R183.1 R184.1 U24.45(I2C_ADDR)
NetR185_1: R185.1 ; port MFX_IRQOUT
NetR185_2: R185.2 U24.46(IRQOUT)
NetU22_G3: U24.15(GPIO5) ; port MFX_IO5
NetU24_18: U24.18(GPIO0) ; port MFX_IO0
NetU24_19: U24.19(GPIO1) ; port MFX_IO1
NetU24_20: U24.20(GPIO2) ; port MFX_IO2
NetU24_26: U24.26(GPIO13) ; port MFX_IO13
NetU24_27: U24.27(GPIO14) ; port MFX_IO14
NetU24_28: U24.28(GPIO15) ; port MFX_IO15
NetU24_29: U24.29(GPIO8) ; port MFX_IO8
NetU24_30: U24.30(GPIO9) ; port MFX_IO9
NetU24_31: U24.31(GPIO10) ; port MFX_IO10
NetU24_32: U24.32(GPIO11) ; port MFX_IO11
NetU24_33: U24.33(GPIO12) ; port MFX_IO12
NetU24_39: U24.39(GPIO3) ; port MFX_IO3
NetU24_40: U24.40(GPIO4) ; port MFX_IO4

Not connected (* = marked no-connect by the designer): CN22 5; U24 3(IDD_CAL/GPO4) 4(IDD_SH0) 5(IDD_SH1/GPO5) 6(IDD_SH2/GPO6) 10(TSC_XP/GPO0) 11(TSC_XN/GPO1) 12(TSC_YP/GPO2) 13(TSC_YN/GPO3) 25(IDD_MEAS) 38(IDD_SH3/GPO7) 41(IDD_VDD_MCU)

### Notes on the sheet
- MFX
  Multi Function eXpander
- one capacitor close to each MFX pins: VDD, VDD_1, VDD_2, VDD_3
- PI8
- PA0
- PB6
- PB7
- (near U24) Default I2C Address:1000010
- Title:
- Project:
- Size:
- Date:
- A4
- Reference:
- Sheet:
- Revision:
- of
- (in symbol MFX) MFX_V3

### Library data of the parts
C76 = Cap_1uF_POL_10%_TANA: Polarized Capacitor,1uF,16V,10%,typeA,AVX; Manuf_Part_1: TAJA105K016R; Revision: July-2002: Re-released for DXP Platform.; Value: 1uF; Order: TAJA105K016R; Manuf_1: AVX; Distrib: *
C82 C85 C163 C167-C169 C171 = Cap_100nF_X7R_10%_0402: Capacitor,100nF,16V,X7R,10%,0402,YAGEO; Manuf_Part_1: CC0402KRX7R7BB104; Revision: July-2002: Re-released for DXP Platform.; Value: 100nF; Order: CC0402KRX7R7BB104; Manuf_1: YAGEO
CN22 = Header 3X2: Header, 3-Pin, Dual row; Revision: 17-Jul-2002: Re-released for DXP Platform.; Publisher: Altium Limited
D15 = Diode: Default Diode; Code - JEDEC: DO-214-AB; Published: 8-Jun-2000; Revision: July-2002: Re-released for DXP Platform.; Publisher: Altium Limited
L8 = BEAD_600R_350MA_0603: Bead,600R,350mA,0603,FCM1608KF-601T03,Tai-tech; Manuf_2: TDK; Manuf_Part_2: MPZ1608S300A; Value: 100uH; Comment_1: bead,30R,5A,0603,MPZ1608S300A,TDK; Revision: July-2002: Re-released for DXP Platform.; Manuf_Part_1: FCM1608KF-601T03; Order: FCM1608KF-601T03; Manuf_1: Tai-tech
R166 = res1: Resistor; Value: 1K; Ordered by: Subcon; Published: 8-Jun-2000; Revision: July-2002: Re-released for DXP Platform.; Publisher: Altium Limited
R170 R174 R182 = Resistor_ST: Resistor 0402 / 0603 / 0805; Description: Resistor 0402 or 0603 or 0805; Value: 10K
R172 R180 R181 R185 = Res1: Resistor; Value: 1K; Ordered by: Subcon; Published: 8-Jun-2000; Revision: July-2002: Re-released for DXP Platform.; Publisher: Altium Limited
R173 R183 = Res1: Resistor; Value: 1K; Published: 8-Jun-2000; Revision: July-2002: Re-released for DXP Platform.; Publisher: Altium Limited
R184 = Resistor_ST: Resistor 0402 / 0603 / 0805; Description: Resistor 0402 or 0603 or 0805; Value: 10K
TP10 = TP
U24 = MFX: Multifunction expander

## Sheet USB_OTG_FS.SchDoc: USB_OTG_FS
size A4; DocumentNumber: MB1246; Revision: B.1; SheetNumber: 9; SheetTotal: 17; Project: STM32H7xxI-EVAL
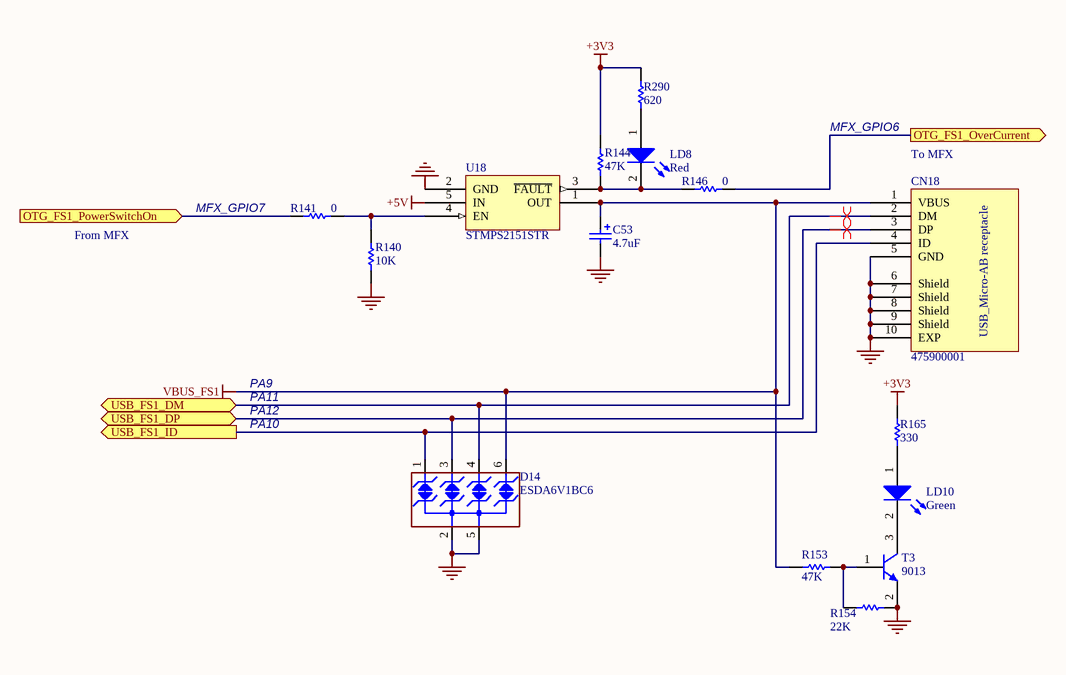
[diagram p3: USB_OTG_FS.SchDoc]

### Parts
C53  4.7uF  [TAN-A]
CN18  475900001  [MOLEX_47590001]
D14  ESDA6V1BC6  [SOT23-6L]
LD8  Red  [0603D]
LD10  Green  [0603D]
R140  10K  [0603R]
R141  0  [0603R]
R144  47K  [0603R]
R146  0  [0603R]
R153  47K  [0603R]
R154  22K  [0603R]
R165  330  [0603R]
R290  620  [0603R]
T3  9013  [SOT-23]
U18  STMPS2151STR  [SOT23-5]

### Ports
OTG_FS1_OverCurrent (out), OTG_FS1_PowerSwitchOn (in), USB_FS1_DM (bidir), USB_FS1_DP (bidir), USB_FS1_ID (out)

### Nets
+3V3: R144.1 R165.2 R290.2
+5V: U18.5(IN)
GND: C53.2 CN18.5(GND) CN18.6(Shield) CN18.7(Shield) CN18.8(Shield) CN18.9(Shield) CN18.10(EXP) D14.2(IO2) D14.5(IO4) R140.1 R154.1 T3.2(E) U18.2(GND)
VBUS_FS1: C53.1 CN18.1(VBUS) D14.6(NC) R153.1 U18.1(OUT)
NetCN18_2: CN18.2(DM) D14.4(IO3) ; port USB_FS1_DM
NetCN18_3: CN18.3(DP) D14.3(GND) ; port USB_FS1_DP
NetCN18_4: CN18.4(ID) D14.1(IO1) ; port USB_FS1_ID
NetLD8_1: LD8.1(A) R290.1
NetLD8_2: LD8.2(K) R144.2 R146.2 U18.3(~{FAULT})
NetLD10_1: LD10.1(A) R165.1
NetLD10_2: LD10.2(K) T3.3(C)
NetR140_2: R140.2 R141.1 U18.4(EN)
NetR141_2: R141.2 ; port OTG_FS1_PowerSwitchOn
NetR146_1: R146.1 ; port OTG_FS1_OverCurrent
NetR153_2: R153.2 R154.2 T3.1(B)

### Layout directives
differential pair: NetCN18_2, NetCN18_3

### Notes on the sheet
- MFX_GPIO6
- (near R141) MFX_GPIO7
- (near CN18) To MFX
- From MFX
- PA9
- PA11
- PA12
- PA10
- Title:
- Project:
- Size:
- Date:
- A4
- Reference:
- Sheet:
- Revision:
- of
- (in symbol 475900001) USB_Micro-AB receptacle

### Library data of the parts
C53 = Cap Pol1: Polarized Capacitor (Radial); Value: 47uF; Published: 8-Jun-2000; Revision: July-2002: Re-released for DXP Platform.; Publisher: Altium Limited
D14 = ESDA6V1BC6: 4-line ESD protection; Manuf_1: STM; Manuf_Part_1: ESDA5V3L; Description: Dual Transil array for ESD protection; Ref St: 9179034; Provided: ST; ECCN_US/EU: EAR99/NEC; Distrib: ST; Order: ESDA5V3L; Ordered by: STM
LD8 LD10 = LED2: Typical RED, GREEN, YELLOW, AMBER GaAs LED; Published: 8-Jun-2000; Revision: July-2002: Re-released for DXP Platform.; Publisher: Altium Limited
R140 R141 R146 R290 = Res1: Resistor; Value: 1K; Published: 8-Jun-2000; Revision: July-2002: Re-released for DXP Platform.; Publisher: Altium Limited
R144 R153 R154 R165 = res1: Resistor; Value: 1K; Published: 8-Jun-2000; Revision: July-2002: Re-released for DXP Platform.; Publisher: Altium Limited
T3 = NPN: NPN Bipolar Transistor; Code - JEDEC: TO-226-AA; Published: 8-Jun-2000; Revision: July-2002: Re-released for DXP Platform.; Publisher: Altium Limited
U18 = STMPS2141STR

## Nets that join several sheets
+3V3: MB1246 (R209.1 R212.1), Audio (11 pins), MFX (13 pins), USB_OTG_FS (R144.1 R165.2 R290.2)
GND: Audio (43 pins), MFX (16 pins), USB_OTG_FS (13 pins)
NetR141_2: MFX (U24.17), USB_OTG_FS (R141.2)
NetR146_1: MFX (U24.16), USB_OTG_FS (R146.1)
NetR155_1: MB1246 (R212.2), Audio (R155.1), MFX (R180.1)
NetR160_1: MB1246 (R209.2), Audio (R160.1), MFX (R181.1)
NetU22_G3: Audio (U22.G3), MFX (U24.15)